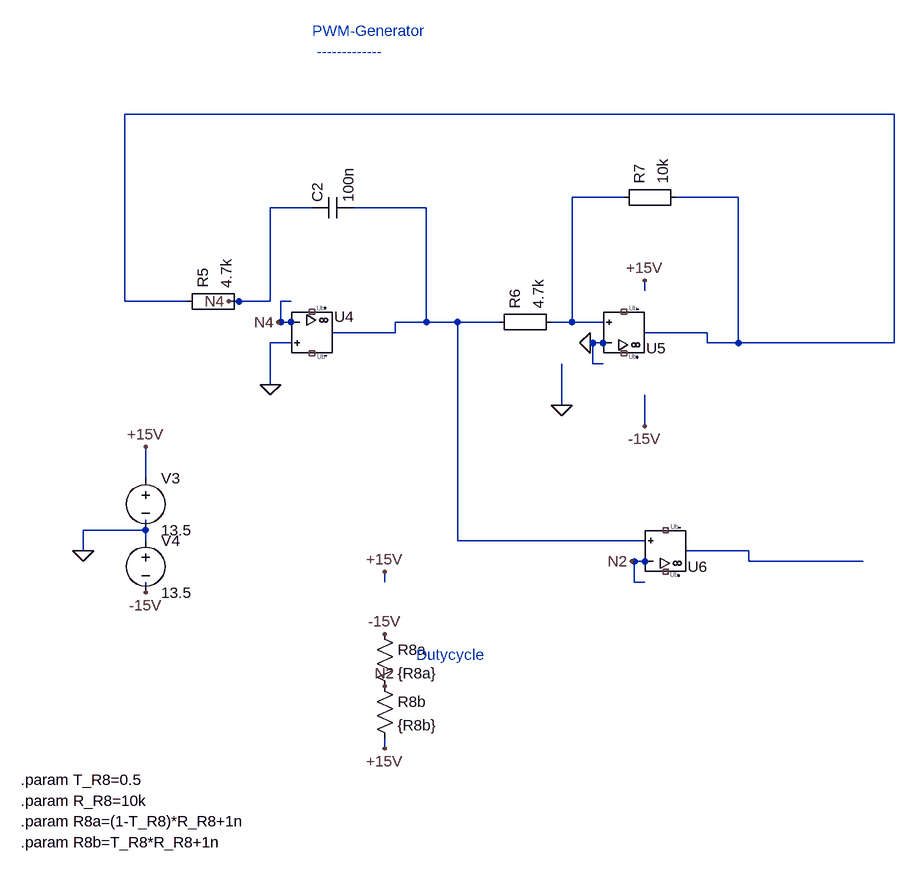
[diagram p0: schematic 9_6_PWM_Dreieck-Rechteck-Generator (1).asc]
9_6_PWM_Dreieck-Rechteck-Generator (1).asc, the LTspice schematic file:
Version 4
SHEET 1 880 680
WIRE 480 528 464 528
WIRE 464 528 464 496
WIRE 464 496 480 496
WIRE 544 544 640 544
WIRE 640 544 640 528
WIRE 576 352 592 352
WIRE 960 560 944 560
WIRE 944 560 944 592
WIRE 944 592 960 592
WIRE 1024 544 1120 544
WIRE 1120 544 1120 560
WIRE 256 848 256 832
WIRE 256 944 256 928
WIRE 1024 896 1008 896
WIRE 1008 896 1008 928
WIRE 1008 928 1024 928
WIRE 1088 880 1184 880
WIRE 1184 880 1184 896
WIRE 880 528 912 528
WIRE 640 528 688 528
WIRE 448 496 400 496
WIRE 512 352 448 352
WIRE 448 352 448 496
WIRE 688 528 736 528
WIRE 592 352 688 352
WIRE 688 352 688 528
WIRE 1072 336 1168 336
WIRE 1168 336 1168 560
WIRE 480 560 448 560
WIRE 448 560 448 624
WIRE 912 528 912 336
WIRE 912 336 992 336
WIRE 960 528 912 528
WIRE 1120 560 1168 560
WIRE 256 768 256 720
WIRE 256 848 256 864
WIRE 160 880 160 848
WIRE 160 848 256 848
WIRE 1024 464 1024 480
WIRE 1024 688 1024 640
WIRE 896 592 896 656
WIRE 1168 560 1408 560
WIRE 1408 560 1408 208
WIRE 1408 208 224 208
WIRE 224 208 224 496
WIRE 224 496 320 496
WIRE 736 528 800 528
WIRE 1024 864 736 864
WIRE 736 864 736 528
WIRE 1360 896 1184 896
WIRE 624 928 624 912
WIRE 960 560 940 560
WIRE 480 528 460 528
WIRE 400 496 384 496
WIRE 624 1168 624 1184
WIRE 1024 896 1004 896
FLAG 896 656 0
FLAG 448 624 0
FLAG 160 880 0
FLAG 160 880 0
FLAG 896 656 0
FLAG 448 624 0
FLAG 940 560 0
FLAG 460 528 N4
FLAG 384 496 N4
FLAG 256 720 +15V
FLAG 1024 464 +15V
FLAG 624 912 +15V
FLAG 624 1184 +15V
FLAG 256 944 -15V
FLAG 1024 688 -15V
FLAG 624 1008 -15V
FLAG 624 1088 N2
FLAG 1004 896 N2
SYMBOL UniversalOpAmp2 512 544 R0
SYMATTR InstName U4
SYMATTR Value UniversalOpAmp2
SYMBOL Misc\EuropeanResistor 304 512 R270
SYMATTR InstName R5
SYMATTR Value 4.7k
SYMBOL Misc\EuropeanResistor 784 544 R270
SYMATTR InstName R6
SYMATTR Value 4.7k
SYMBOL Misc\EuropeanResistor 976 352 R270
SYMATTR InstName R7
SYMATTR Value 10k
SYMBOL cap 512 368 R270
SYMATTR InstName C2
SYMATTR Value 100n
SYMBOL UniversalOpAmp2 992 544 M180
SYMATTR InstName U5
SYMATTR Value UniversalOpAmp2
SYMBOL voltage 256 752 R0
SYMATTR InstName V3
SYMATTR Value 13.5
SYMBOL voltage 256 848 R0
SYMATTR InstName V4
SYMATTR Value 13.5
SYMBOL UniversalOpAmp2 1056 880 M180
SYMATTR InstName U6
SYMATTR Value UniversalOpAmp2
SYMBOL res 608 992 R0
SYMATTR InstName R8a
SYMATTR Value {R8a}
SYMBOL res 608 1072 R0
SYMATTR InstName R8b
SYMATTR Value {R8b}
TEXT 64 1232 Left 2 !.param T_R8=0.5
TEXT 64 1264 Left 2 !.param R_R8=10k
TEXT 64 1296 Left 2 !.param R8a=(1-T_R8)*R_R8+1n
TEXT 64 1328 Left 2 !.param R8b=T_R8*R_R8+1n
TEXT 512 80 Left 2 ;PWM-Generator \n -------------
TEXT 672 1040 Left 2 ;Dutycycle

The netlist it stands for:
* 9_6_PWM_Dreieck-Rechteck-Generator (1).asc
XU4 0 N4 NC_01 NC_02 N001 level2 UniversalOpAmp2 Avol=1Meg GBW=10Meg Slew=10Meg Ilimit=25m Rail=0 Vos=0 En=0 Enk=0 In=0 Ink=0 Rin=500Meg  ; pins In+ In- V+ V- OUT
R5 N002 N4 4.7k
R6 N001 N004 4.7k
R7 N004 N002 10k
C2 N4 N001 100n
XU5 N004 0 NC_03 NC_04 N002 level2 UniversalOpAmp2 Avol=1Meg GBW=10Meg Slew=10Meg Ilimit=25m Rail=0 Vos=0 En=0 Enk=0 In=0 Ink=0 Rin=500Meg  ; pins In+ In- V+ V- OUT
V3 +15V 0 13.5
V4 0 -15V 13.5
XU6 N001 N2 NC_05 NC_06 N003 level2 UniversalOpAmp2 Avol=1Meg GBW=10Meg Slew=10Meg Ilimit=25m Rail=0 Vos=0 En=0 Enk=0 In=0 Ink=0 Rin=500Meg  ; pins In+ In- V+ V- OUT
R8a -15V N2 {R8a}
R8b N2 +15V {R8b}
.param T_R8=0.5
.param R_R8=10k
.param R8a=(1-T_R8)*R_R8+1n
.param R8b=T_R8*R_R8+1n
* PWM-Generator
*  -------------
* Dutycycle
.lib UniversalOpAmp2.lib
.backanno
.end